# Altium schematic sheet Magnetometer.SchDoc: Magnetometer
size 203 x 127 mm; DrawnBy: Kace Chandler; DocumentNumber: 4; SheetNumber: 4; SheetTotal: 23
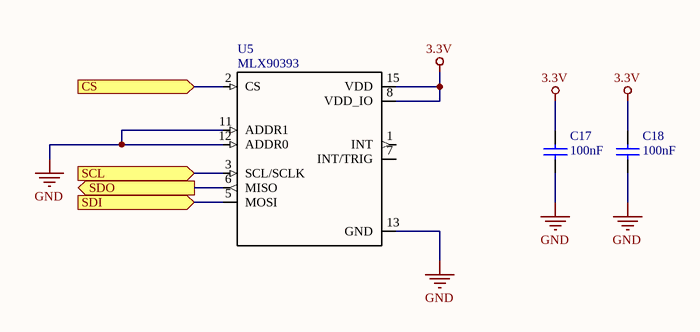
[diagram p0: Magnetometer.SchDoc]

## Parts
C17  value 100nF  [0603 to 0805 SMD]  (hidden comment: Cap)
C18  value 100nF  [0603 to 0805 SMD]  (hidden comment: Cap)
U5  MLX90393  [QFN-16_WITH_AXIES]

## Ports
CS (in), SCL (in), SDI (in), SDO (out)

## Nets
3.3V: C17.2 C18.2 U5.8(VDD_IO) U5.15(VDD)
GND: C17.1 C18.1 U5.11(ADDR1) U5.12(ADDR0) U5.13(GND)
CS: U5.2(CS) ; port CS
SCL: U5.3(SCL/SCLK) ; port SCL
SDI: U5.5(MOSI) ; port SDI
SDO: U5.6(MISO) ; port SDO

Not connected (* = marked no-connect by the designer): U5 1(INT) 7(INT/TRIG)

## Library data of the parts
U5 = MLX90393: Magnetometer (Compass); Supplier 1: Digi-Key; Supplier Part Number 1: MLX90393ELW-ABA-011-RECT-ND